# EAGLE schematic db9 (EAGLE 6.4)
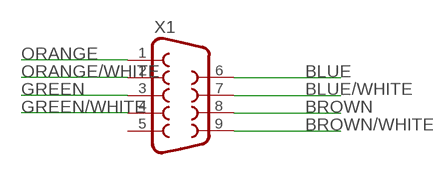
[diagram p0: schematic, sheet 1]

## Parts
X1  DB9FEMALE  [DB9]

## Nets
BLUE: X1.6
BLUE/WHITE: X1.7
BROWN: X1.8
BROWN/WHITE: X1.9
GREEN: X1.3
GREEN/WHITE: X1.4
ORANGE: X1.1
ORANGE/WHITE: X1.2
Unconnected: X1.5

## Library data of the parts
X1 = SparkFun-Connectors:DB9: DB9 Connector Standard DB9 (D-Sub 9) serial connector. Can be used for CAN bus as well as RS485 and RS232. Footprint production proven. Spark Fun Electronics SKU : PRT-00429